# Altium schematic sheet Dash22_LEDS.SchDoc
size A
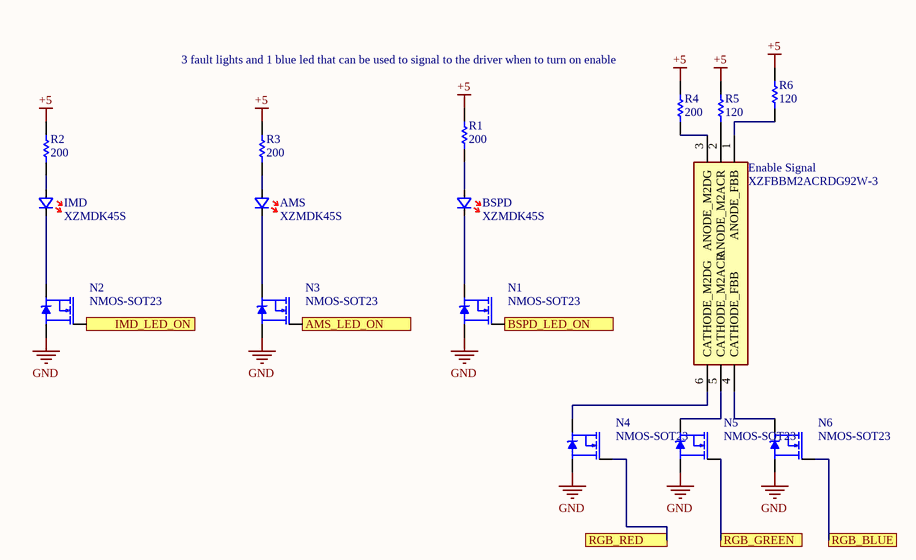
[diagram p0: Dash22_LEDS.SchDoc]

## Parts
AMS  XZMDK45S  [LED_XZFBB45S]
BSPD  XZMDK45S  [LED_XZFBB45S]
Enable_Signal  XZFBBM2ACRDG92W-3  [XZFBBM2ACRDG92W3]
IMD  XZMDK45S  [LED_XZFBB45S]
N1  NMOS-SOT23  [SOT23]
N2  NMOS-SOT23  [SOT23]
N3  NMOS-SOT23  [SOT23]
N4  NMOS-SOT23  [SOT23]
N5  NMOS-SOT23  [SOT23]
N6  NMOS-SOT23  [SOT23]
R1  200  [RESC1608X55X25ML10T15]
R2  200  [RESC1608X55X25ML10T15]
R3  200  [RESC1608X55X25ML10T15]
R4  200  [RESC1608X55X25ML10T15]
R5  120  [RESC1608X55X25ML10T15]
R6  120  [RESC1608X55X25ML10T15]

## Ports
AMS_LED_ON, BSPD_LED_ON, IMD_LED_ON, RGB_BLUE, RGB_GREEN, RGB_RED

## Nets
+5: R1.2 R2.2 R3.2 R4.2 R5.2 R6.2
GND: N1.2(S) N2.2(S) N3.2(S) N4.2(S) N5.2(S) N6.2(S)
AMS_LED_ON: N3.1(G) ; port AMS_LED_ON
BSPD_LED_ON: N1.1(G) ; port BSPD_LED_ON
IMD_LED_ON: N2.1(G) ; port IMD_LED_ON
RGB_BLUE: N6.1(G) ; port RGB_BLUE
RGB_GREEN: N5.1(G) ; port RGB_GREEN
RGB_RED: N4.1(G) ; port RGB_RED
NetAMS_A: AMS.A R3.1
NetAMS_K: AMS.K N3.3(D)
NetBSPD_A: BSPD.A R1.1
NetBSPD_K: BSPD.K N1.3(D)
NetEnable_Signal_1: Enable_Signal.1(ANODE_FBB) R6.1
NetEnable_Signal_2: Enable_Signal.2(ANODE_M2ACR) R5.1
NetEnable_Signal_3: Enable_Signal.3(ANODE_M2DG) R4.1
NetEnable_Signal_4: Enable_Signal.4(CATHODE_FBB) N6.3(D)
NetEnable_Signal_5: Enable_Signal.5(CATHODE_M2ACR) N5.3(D)
NetEnable_Signal_6: Enable_Signal.6(CATHODE_M2DG) N4.3(D)
NetIMD_A: IMD.A R2.1
NetIMD_K: IMD.K N2.3(D)

## Notes on the sheet
- 3 fault lights and 1 blue led that can be used to signal to the driver when to turn on enable

## Library data of the parts
AMS BSPD IMD = CMP-009-000234-1: Design Item ID: LED_XZFBB45S; Source: ife19_Elec_Library.schlib
Enable_Signal = XZFBBM2ACRDG92W-3: LED; Manufacturer_Name: SunLED; Datasheet Link: https://www.sunledusa.com/products/spec/XZFBBM2ACRDG92W-3.pdf; Height: 1.25mm; Manufacturer_Part_Number: XZFBBM2ACRDG92W-3
N1-N6 = CMP-009-000226-1: Source: ife19_Elec_Library.schlib; Design Item ID: NMOS-SOT23
R1-R6 = CMP-009-000010-1: Chip Resistor, 0 Ohm, 0.1 W, -55 to 155 degC, 0603 (1608 Metric); Source: Integrated_Library - 12.03.21 - 15.39.SchLib; Design Item ID: CMP-009-00006-4